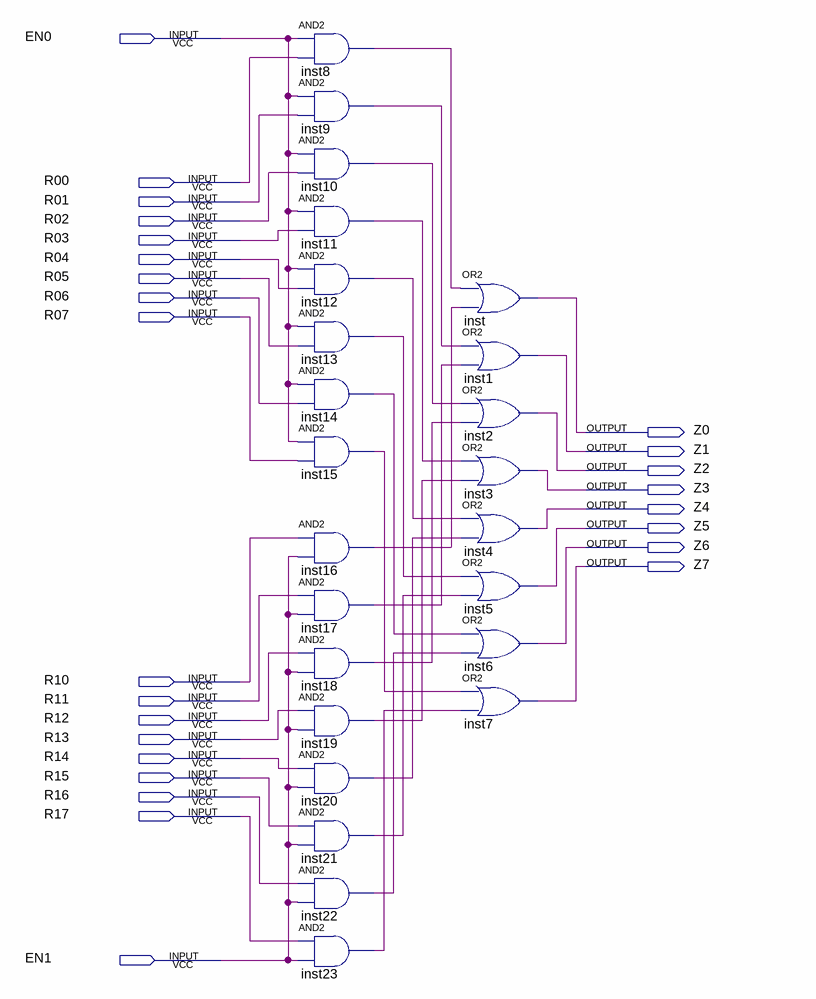
[diagram p0: schematic sheet]
// Quartus schematic 2_MUX.bdf as structural Verilog: 24 symbols, 26 pins
module \2_MUX  (
  input  EN0,
  input  R00,
  input  R01,
  input  R02,
  input  R03,
  input  R04,
  input  R05,
  input  R06,
  input  R07,
  input  R10,
  input  R11,
  input  R12,
  input  R13,
  input  R14,
  input  R15,
  input  R16,
  input  R17,
  input  EN1,
  output Z0,
  output Z1,
  output Z2,
  output Z3,
  output Z4,
  output Z5,
  output Z6,
  output Z7
);

  wire inst8_out, inst9_out, inst10_out, inst11_out, inst12_out, inst13_out, inst14_out, inst15_out,
       inst16_out, inst17_out, inst18_out, inst19_out, inst20_out, inst21_out, inst22_out, inst23_out;

  and inst8 (inst8_out, EN0, R00);
  and inst9 (inst9_out, EN0, R01);
  and inst10 (inst10_out, EN0, R02);
  and inst11 (inst11_out, EN0, R03);
  and inst12 (inst12_out, EN0, R04);
  and inst13 (inst13_out, EN0, R05);
  and inst14 (inst14_out, EN0, R06);
  and inst15 (inst15_out, EN0, R07);
  and inst16 (inst16_out, R10, EN1);
  and inst17 (inst17_out, R11, EN1);
  and inst18 (inst18_out, R12, EN1);
  and inst19 (inst19_out, R13, EN1);
  and inst20 (inst20_out, R14, EN1);
  and inst21 (inst21_out, R15, EN1);
  and inst22 (inst22_out, R16, EN1);
  and inst23 (inst23_out, R17, EN1);
  or inst (Z0, inst8_out, inst16_out);
  or inst1 (Z1, inst9_out, inst17_out);
  or inst2 (Z2, inst10_out, inst18_out);
  or inst3 (Z3, inst11_out, inst19_out);
  or inst4 (Z4, inst12_out, inst20_out);
  or inst5 (Z5, inst13_out, inst21_out);
  or inst6 (Z6, inst14_out, inst22_out);
  or inst7 (Z7, inst15_out, inst23_out);
endmodule
